# EAGLE schematic one axis JStep (EAGLE 6.3)
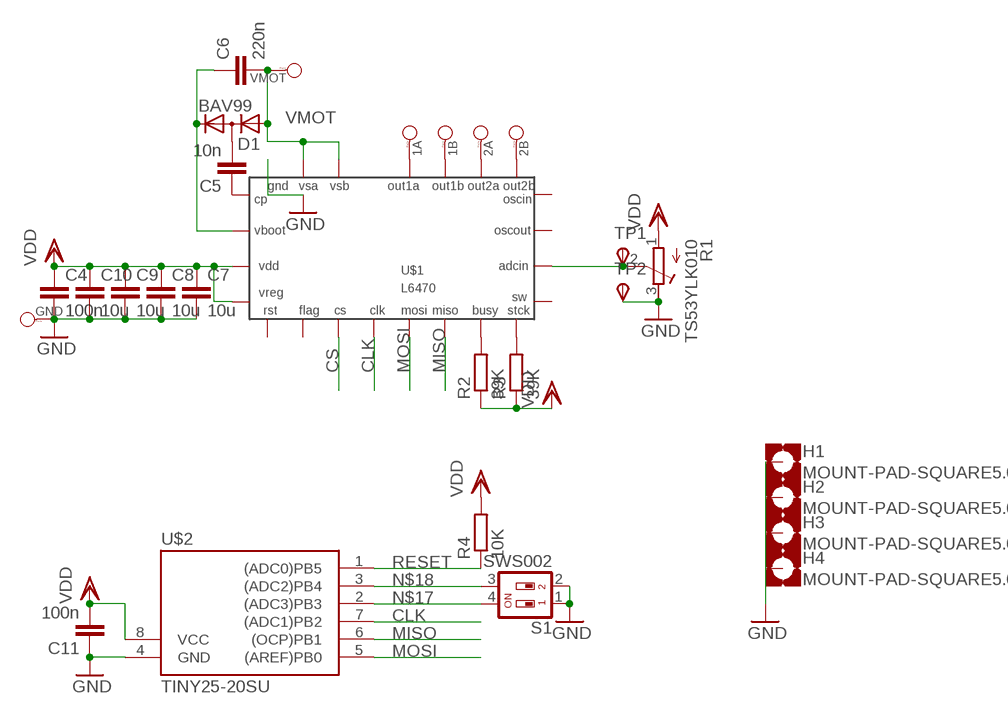
[diagram p0: schematic, sheet 1]

## Parts
1A  WAGO256  [WAGO256]
1B  WAGO256  [WAGO256]
2A  WAGO256  [WAGO256]
2B  WAGO256  [WAGO256]
C4  100n  C-EUC0603  [C0603]
C5  10n  C-EUC0603  [C0603]
C6  220n  C-EUC0805  [C0805]
C7  10u  C-EUC0805  [C0805]
C8  10u  C-EUC0805  [C0805]
C9  10u  C-EUC0805  [C0805]
C10  10u  C-EUC0805  [C0805]
C11  100n  C-EUC0603  [C0603]
D1  BAV99  BAV199  [SOT23]
GND  WAGO256  [WAGO256]
H1  MOUNT-PAD-SQUARE5.0  [5,0-PAD-SQUARE]
H2  MOUNT-PAD-SQUARE5.0  [5,0-PAD-SQUARE]
H3  MOUNT-PAD-SQUARE5.0  [5,0-PAD-SQUARE]
H4  MOUNT-PAD-SQUARE5.0  [5,0-PAD-SQUARE]
R1  TS53YLK010  R-TRIMM5X  [RTRIM5X]
R2  39K  R-EU_R0603  [R0603]
R3  39K  R-EU_R0603  [R0603]
R4  10K  R-EU_R0603  [R0603]
S1  SWS002  [SMS-002]
TP1  TPSPAD1-20  [P1-20]
TP2  TPSPAD1-20  [P1-20]
U$1  L6470  [POWERSO-36]
U$2  TINY25-20SU  [SOIC8]
VMOT  WAGO256  [WAGO256]

## Nets
CLK: U$1.26(CLK) U$2.7((ADC1)PB2)
CS: U$1.30(CS)
GND: C4.2 C7.2 C8.2 C9.2 C10.2 C11.1 GND.1 H1.B5(MOUNT) H2.B5(MOUNT) H3.B5(MOUNT) H4.B5(MOUNT) R1.3(A) S1.1 S1.2 TP2.TP(PP) U$1.1(GND) U$1.12(GND) U$1.19(GND) U$1.28(GND) U$2.4(GND)
MISO: U$1.25(MISO) U$2.6((OCP)PB1)
MOSI: U$1.27(MOSI) U$2.5((AREF)PB0)
N$1: R1.2(S) TP1.TP(PP) U$1.8(ADCIN)
N$3: R2.2 U$1.29(BUSY)
N$4: R3.2 U$1.32(STCK)
N$8: C5.1 U$1.13(CP)
N$9: C5.2 D1.3(AC)
N$10: C6.1 D1.2(C) U$1.14(VBOOT)
N$13: 1A.1 U$1.2(O1A) U$1.3(O1A)
N$14: 1B.1 U$1.17(O1B) U$1.18(O1B)
N$15: 2A.1 U$1.35(O2A) U$1.36(O2A)
N$16: 2B.1 U$1.20(O2B) U$1.21(O2B)
N$17: S1.4 U$2.2((ADC3)PB3)
N$18: S1.3 U$2.3((ADC2)PB4)
RESET: R4.1 U$2.1((ADC0)PB5)
VDD: C4.1 C7.1 C8.1 C9.1 C10.1 C11.2 R1.1(E) R2.1 R3.1 R4.2 U$1.9(VREG) U$1.24(VDD) U$2.8(VCC)
VMOT: C6.2 D1.1(A) U$1.4(VSA) U$1.5(VSA) U$1.15(VSB) U$1.16(VSB) U$1.22(VSB) U$1.23(VSB) U$1.33(VSA) U$1.34(VSA) VMOT.1
Unconnected: U$1.6(RST) U$1.7(SW) U$1.10(OSIN) U$1.11(OSOUT) U$1.31(FLG)

## Library data of the parts
1A 1B 2A 2B GND VMOT = #PaJa_konektory:WAGO256: Konektor WAGO - RM 5,08mm - s packou
C4-C11 = rcl:C-EU: CAPACITOR, European symbol
D1 = diode:BAV199: DIODE low-leakage double diode
H1-H4 = holes:MOUNT-PAD-SQUARE: MOUNTING PAD, square
R1 = resistor:R-TRIMM: Trimm resistor
R2-R4 = rcl:R-EU_: RESISTOR, European symbol
S1 = smd-special:SWS002: SMD Dip Switch 2 pol.
TP1 TP2 = testpad:TPS: TEST PIN
U$1 = st-microelectronics:L6470
U$2 = avr-5:TINY25